# Altium schematic sheet machnguon.SchDoc
size A
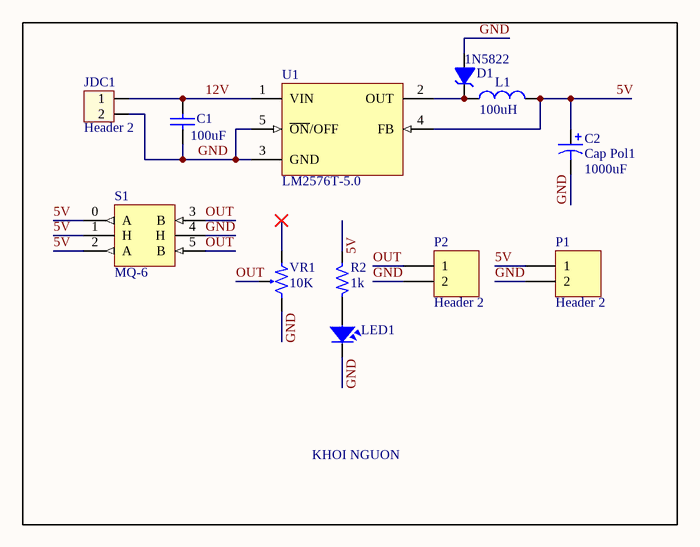
[diagram p0: machnguon.SchDoc]

## Parts
C1  value 100uF  [CP1.5/2.5]  (hidden comment: Cap)
C2  Cap Pol1  value 1000uF  [CP2/4]
D1  1N5822  [DZ0.5A]
JDC1  Header 2  [HED2]
L1  100uH  [L01]
LED1  (no value)  [LED-3]
P1  Header 2  [HDR1X2]
P2  Header 2  [HDR1X2]
R2  1k  [SM-0805]
S1  MQ-6  [MQ6]
U1  LM2576T-5.0  [TO170P1420-6N]
VR1  10K  [VR1]

## Blocks framed on the sheet
KHOI NGUON: C1 C2 D1 JDC1 L1 LED1 P1 P2 R2 S1 U1 VR1

## Nets
5V: C2.1 L1.2 P1.1 R2.1 S1.0(A) S1.1(H) S1.2(A) U1.4(FB)
12V: C1.2 JDC1.1 U1.1(VIN)
GND: C1.1 C2.2 D1.1(A) JDC1.2 LED1.2 P1.2 P2.2 S1.4(H) U1.3(GND) U1.5(~{ON}/OFF) VR1.3
OUT: P2.1 S1.3(B) S1.5(B) VR1.2
NetD1_2: D1.2(K) L1.1 U1.2(OUT)
NetLED1_1: LED1.1 R2.2

Not connected (* = marked no-connect by the designer): VR1 1*

## Library data of the parts
C1 = Cap: Capacitor; Published: 8-Jun-2000; LatestRevisionDate: 17-Jul-2002; LatestRevisionNote: Re-released for DXP Platform.; PackageReference: RAD-0.3; Publisher: Altium Limited; PackageDescription: Radial Cap, Thru-Hole; 2 Leads; 0.3 in Pin Spacing
C2 = Cap Pol1: Polarized Capacitor (Radial); Published: 8-Jun-2000; LatestRevisionDate: 17-Jul-2002; LatestRevisionNote: Re-released for DXP Platform.; PackageReference: RB7.6-15; Publisher: Altium Limited; PackageDescription: Polarized Capacitor (Radial); 2 Leads
D1 = DZ: Diode Zenner; Value: 3v3
JDC1 = Hed2: Header 2 (Green); Value: Header 2
L1 = L1: Inductor; Value: 150 mH
LED1 = LED: LED Single colour Green and Red; Value: LED 3 ly Single Colour; Description: LED 5 ly Single Colour; Description: Led  Vuong
P1 P2 = Header 2: Header, 2-Pin; LatestRevisionDate: 17-Jul-2002; LatestRevisionNote: Re-released for DXP Platform.; Publisher: Altium Limited
R2 = R: Resistor 1/4W; Value: R1/4W - 1K
S1 = MQ-6: Gas and Smoke Sensor
U1 = LM2576T-5.0: SIMPLE SWITCHER; 3A Step-Down Voltage Regulator; Manufacturer: National Semiconductor; PackageTopMarking: NSUZXYTT*LM2576T*-5.0 P+; PowerWise: N; FirstPublished: 4-Dec-2008; DatasheetVersion: Aug-2004; PackageVersion: revJ, Jan-1992; PackageReference: T05A; Publisher: Altium Limited; PackageDescription: TO-220, Molded, 5 Lead, Straight; CompType: Switcher; PartNumber: LM2576T-5.0; RoHS: O; PinCount: 5; DigiKeyPartNumber: LM2576T-5.0-ND; Code_JEDEC: TO-220-AB; ComponentLink1Description: LM2576 Datasheet; ComponentLink1URL: http://www.national.com/ds/LM/LM2576.pdf; ComponentLink2Description: LM2576 Web Page; ComponentLink2URL: http://www.national.com/pf/LM/LM2576.html; ComponentLink3Description: T05A Package Page; ComponentLink3URL: http://www.national.com/packaging/folders/t05a.html
VR1 = VR1: Var Resistor; Value: VR 10K